# Altium project Ground Station Pi Hat.PrjPcb
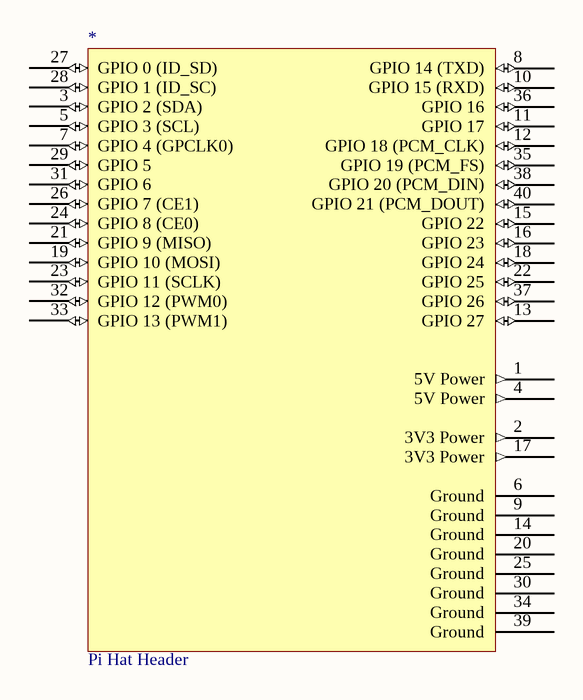
[diagram p0: GRITS Pi Hat.SchDoc]
1 sheet, 1 parts. Net scope: global (net labels, ports and power ports of the same name join across sheets).
Board file: RaspberryHatBoard.PcbDoc

## Sheet GRITS Pi Hat.SchDoc
size A; SheetNumber: 1; SheetTotal: 1

### Parts
*  Pi Hat Header  [CONN_ESQ-120-33-T-D]

### Nets

Not connected (* = marked no-connect by the designer): * 1(5V_Power) 2(3V3_Power) 3(GPIO_2_(SDA)) 4(5V_Power) 5(GPIO_3_(SCL)) 6(Ground) 7(GPIO_4_(GPCLK0)) 8(GPIO_14_(TXD)) 9(Ground) 10(GPIO_15_(RXD)) 11(GPIO_17) 12(GPIO_18_(PCM_CLK)) 13(GPIO_27) 14(Ground) 15(GPIO_22) 16(GPIO_23) 17(3V3_Power) 18(GPIO_24) 19(GPIO_10_(MOSI)) 20(Ground) 21(GPIO_9_(MISO)) 22(GPIO_25) 23(GPIO_11_(SCLK)) 24(GPIO_8_(CE0)) 25(Ground) 26(GPIO_7_(CE1)) 27(GPIO_0_(ID_SD)) 28(GPIO_1_(ID_SC)) 29(GPIO_5) 30(Ground) 31(GPIO_6) 32(GPIO_12_(PWM0)) 33(GPIO_13_(PWM1)) 34(Ground) 35(GPIO_19_(PCM_FS)) 36(GPIO_16) 37(GPIO_26) 38(GPIO_20_(PCM_DIN)) 39(Ground) 40(GPIO_21_(PCM_DOUT))